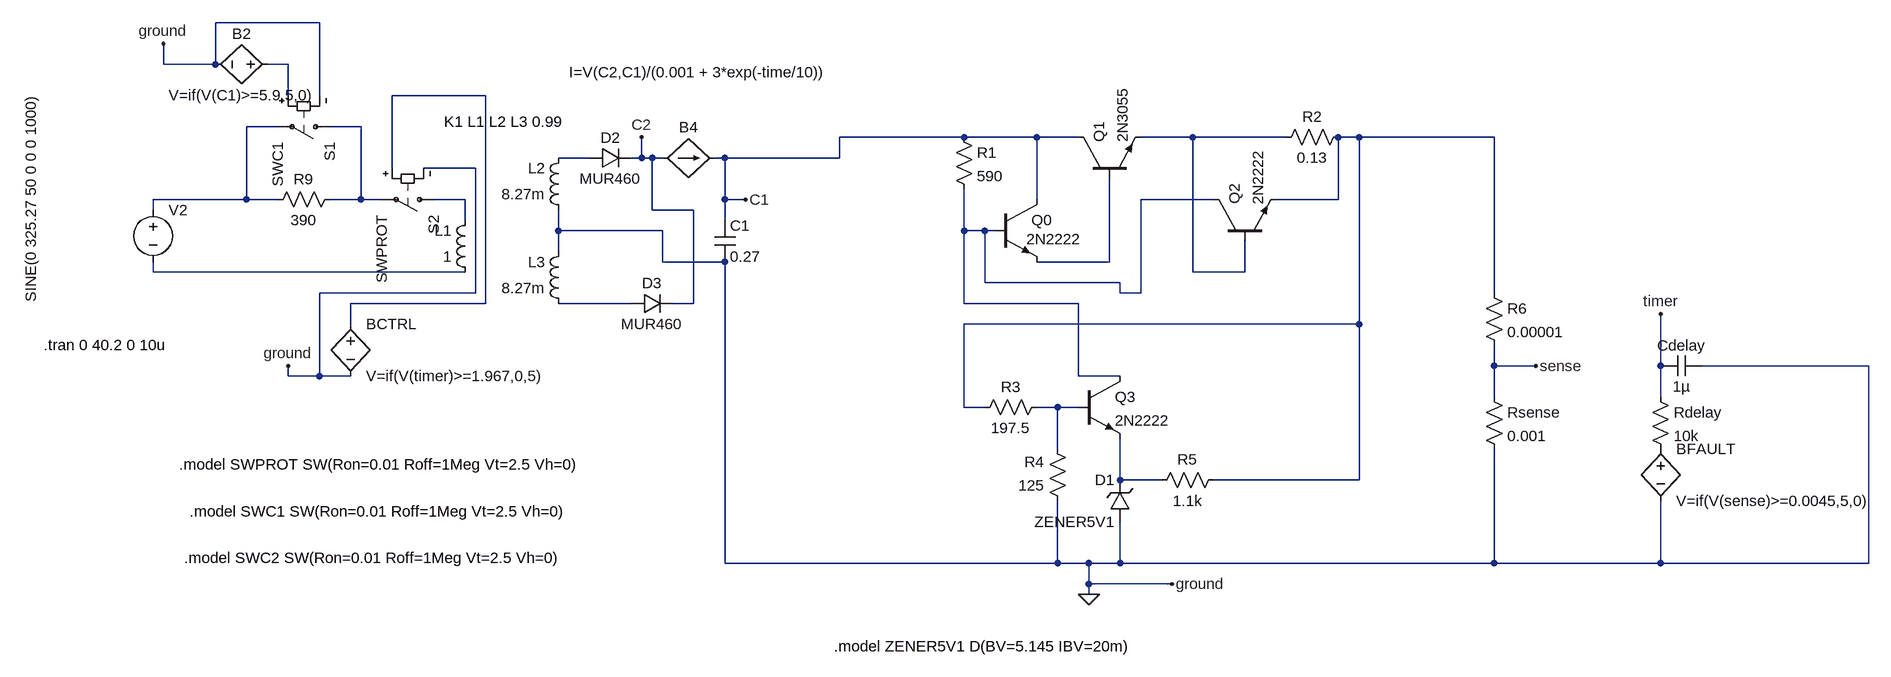
[diagram p0: schematic final... - Copy.asc]
final... - Copy.asc, the LTspice schematic file:
Version 4.1
SHEET 1 2704 768
WIRE -1232 -336 -1392 -336
WIRE -1472 -272 -1472 -304
WIRE -1392 -272 -1392 -336
WIRE -1392 -272 -1472 -272
WIRE -1280 -272 -1312 -272
WIRE -1280 -224 -1280 -272
WIRE -1232 -224 -1232 -336
WIRE -976 -224 -1120 -224
WIRE -1296 -176 -1344 -176
WIRE -1168 -176 -1216 -176
WIRE -240 -160 -432 -160
WIRE -128 -160 -240 -160
WIRE -64 -160 -128 -160
WIRE 112 -160 32 -160
WIRE 256 -160 112 -160
WIRE 368 -160 336 -160
WIRE 576 -160 368 -160
WIRE -816 -128 -864 -128
WIRE -736 -128 -736 -160
WIRE -736 -128 -752 -128
WIRE -720 -128 -736 -128
WIRE -704 -128 -720 -128
WIRE -608 -128 -624 -128
WIRE -432 -128 -432 -160
WIRE -432 -128 -608 -128
WIRE -1120 -112 -1120 -224
WIRE -992 -112 -1072 -112
WIRE -1344 -64 -1344 -176
WIRE -1344 -64 -1488 -64
WIRE -1296 -64 -1344 -64
WIRE -1168 -64 -1168 -176
WIRE -1168 -64 -1216 -64
WIRE -1136 -64 -1168 -64
WIRE -1008 -64 -1056 -64
WIRE -608 -64 -608 -128
WIRE -576 -64 -608 -64
WIRE -128 -64 -128 -160
WIRE 144 -64 32 -64
WIRE 336 -64 336 -160
WIRE 336 -64 240 -64
WIRE -1488 -48 -1488 -64
WIRE -720 -48 -720 -128
WIRE -656 -48 -720 -48
WIRE -1008 -32 -1008 -64
WIRE -608 -32 -608 -64
WIRE -864 -16 -864 -48
WIRE -704 -16 -864 -16
WIRE -240 -16 -240 -80
WIRE -208 -16 -240 -16
WIRE -192 -16 -208 -16
WIRE -864 16 -864 -16
WIRE -704 32 -704 -16
WIRE -608 32 -608 16
WIRE -608 32 -704 32
WIRE -16 32 -16 -96
WIRE -16 32 -128 32
WIRE -1488 48 -1488 32
WIRE -1008 48 -1488 48
WIRE 112 48 112 -160
WIRE 192 48 192 0
WIRE 192 48 112 48
WIRE -208 64 -208 -16
WIRE 0 64 -208 64
WIRE -992 80 -992 -112
WIRE -992 80 -1232 80
WIRE 0 80 0 64
WIRE 32 80 32 -64
WIRE 32 80 0 80
WIRE 576 80 576 -160
WIRE -976 96 -976 -224
WIRE -976 96 -1184 96
WIRE -752 96 -864 96
WIRE -656 96 -656 -48
WIRE -656 96 -688 96
WIRE -240 96 -240 -16
WIRE -64 96 -240 96
WIRE -1184 128 -1184 96
WIRE 368 128 368 -160
WIRE 368 128 -240 128
WIRE 576 192 576 160
WIRE 640 192 576 192
WIRE 832 192 832 112
WIRE 1152 192 896 192
WIRE -1280 208 -1280 192
WIRE -1232 208 -1232 80
WIRE -1232 208 -1280 208
WIRE -1184 208 -1232 208
WIRE -64 208 -64 96
WIRE 0 208 -64 208
WIRE 576 240 576 192
WIRE 832 240 832 192
WIRE -240 256 -240 128
WIRE -208 256 -240 256
WIRE -96 256 -128 256
WIRE -64 256 -96 256
WIRE -96 320 -96 256
WIRE 0 368 0 304
WIRE 64 368 0 368
WIRE 368 368 368 128
WIRE 368 368 144 368
WIRE -608 496 -608 32
WIRE -96 496 -96 400
WIRE -96 496 -608 496
WIRE -48 496 -96 496
WIRE 0 496 0 432
WIRE 0 496 -48 496
WIRE 576 496 576 320
WIRE 576 496 0 496
WIRE 832 496 832 400
WIRE 832 496 576 496
WIRE 1152 496 1152 192
WIRE 1152 496 832 496
WIRE -48 528 -48 496
WIRE 80 528 -48 528
WIRE -48 544 -48 528
FLAG -48 544 0
FLAG 640 192 sense
FLAG -576 -64 C1
FLAG 80 528 ground
FLAG -1280 192 ground
FLAG -1472 -304 ground
FLAG 832 112 timer
FLAG -736 -160 C2
SYMBOL npn -64 -96 R270
SYMATTR InstName Q1
SYMATTR Value 2N3055
SYMBOL npn 144 0 R270
SYMATTR InstName Q2
SYMATTR Value 2N2222
SYMBOL npn -64 208 R0
SYMATTR InstName Q3
SYMATTR Value 2N2222
SYMBOL res -256 -176 R0
SYMATTR InstName R1
SYMATTR Value 590
SYMATTR SpiceLine pwr=1
SYMBOL res 352 -176 R90
WINDOW 0 0 56 VBottom 2
WINDOW 3 32 56 VTop 2
SYMATTR InstName R2
SYMATTR Value 0.13
SYMATTR SpiceLine pwr=10
SYMBOL res -112 240 R90
WINDOW 0 0 56 VBottom 2
WINDOW 3 32 56 VTop 2
SYMATTR InstName R3
SYMATTR Value 197.5
SYMATTR SpiceLine pwr=1
SYMBOL res -80 416 R180
WINDOW 0 36 76 Left 2
WINDOW 3 36 40 Left 2
SYMATTR InstName R4
SYMATTR Value 125
SYMATTR SpiceLine pwr=1
SYMBOL res 48 384 R270
WINDOW 0 32 56 VTop 2
WINDOW 3 0 56 VBottom 2
SYMATTR InstName R5
SYMATTR Value 1.1k
SYMATTR SpiceLine pwr=0.25
SYMBOL zener 16 432 R180
WINDOW 0 24 64 Left 2
WINDOW 3 24 0 Left 2
SYMATTR InstName D1
SYMATTR Value ZENER5V1
SYMBOL voltage -1488 -64 R0
WINDOW 3 -188 158 VLeft 2
WINDOW 123 0 0 Left 0
WINDOW 39 0 0 Left 0
SYMATTR Value SINE(0 325.27 50 0 0 0 1000)
SYMATTR InstName V2
SYMBOL ind -992 64 R180
WINDOW 0 36 80 Left 2
WINDOW 3 36 40 Left 2
SYMATTR InstName L1
SYMATTR Value 1
SYMATTR Type ind
SYMATTR SpiceLine Rser=1m
SYMBOL ind -848 -32 R180
WINDOW 0 36 80 Left 2
WINDOW 3 36 40 Left 2
SYMATTR InstName L2
SYMATTR Value 8.27m
SYMATTR Type ind
SYMATTR SpiceLine Rser=1m
SYMBOL ind -848 112 R180
WINDOW 0 36 80 Left 2
WINDOW 3 36 40 Left 2
SYMATTR InstName L3
SYMATTR Value 8.27m
SYMATTR Type ind
SYMATTR SpiceLine Rser=1m
SYMBOL diode -816 -112 R270
WINDOW 0 32 32 VTop 2
WINDOW 3 0 32 VBottom 2
SYMATTR InstName D2
SYMATTR Value MUR460
SYMBOL diode -752 112 R270
WINDOW 0 32 32 VTop 2
WINDOW 3 0 32 VBottom 2
SYMATTR InstName D3
SYMATTR Value MUR460
SYMBOL cap -624 -32 R0
SYMATTR InstName C1
SYMATTR Value 0.27
SYMATTR SpiceLine Rpar=61
SYMBOL npn -192 -64 R0
WINDOW 3 48 61 Left 2
SYMATTR Value 2N2222
SYMATTR InstName Q0
SYMBOL sw -1200 -176 R90
SYMATTR InstName S1
SYMATTR Value SWC1
SYMBOL sw -1040 -64 R90
SYMATTR InstName S2
SYMATTR Value SWPROT
SYMBOL res 560 224 R0
SYMATTR InstName Rsense
SYMATTR Value 0.001
SYMATTR SpiceLine pwr=5
SYMBOL res -1200 -80 R90
WINDOW 0 0 56 VBottom 2
WINDOW 3 32 56 VTop 2
SYMATTR InstName R9
SYMATTR Value 390
SYMBOL bv -1184 112 R0
SYMATTR InstName BCTRL
SYMATTR Value V=if(V(timer)>=1.967,0,5)
SYMBOL bv -1296 -272 R90
WINDOW 0 -32 56 VBottom 2
WINDOW 3 32 56 VTop 2
SYMATTR InstName B2
SYMATTR Value V=if(V(C1)>=5.9,5,0)
SYMBOL bv 832 304 R0
SYMATTR InstName BFAULT
SYMATTR Value V=if(V(sense)>=0.0045,5,0)
SYMBOL res 816 224 R0
SYMATTR InstName Rdelay
SYMATTR Value 10k
SYMBOL cap 896 176 R90
WINDOW 0 0 32 VBottom 2
WINDOW 3 32 32 VTop 2
SYMATTR InstName Cdelay
SYMATTR Value 1µ
SYMBOL res 560 64 R0
SYMATTR InstName R6
SYMATTR Value 0.00001
SYMATTR SpiceLine pwr=100
SYMBOL bi -704 -128 R270
WINDOW 0 32 40 VTop 2
WINDOW 3 148 56 VBottom 2
SYMATTR InstName B4
SYMATTR Value I=V(C2,C1)/(0.001 + 3*exp(-time/10))
TEXT -440 624 Left 2 !.model ZENER5V1 D(BV=5.145 IBV=20m)
TEXT -1040 -184 Left 2 !K1 L1 L2 L3 0.99
TEXT -1656 160 Left 2 !.tran 0 40.2 0 10u
TEXT -1448 344 Left 2 !.model SWPROT SW(Ron=0.01 Roff=1Meg Vt=2.5 Vh=0)
TEXT -1432 416 Left 2 !.model SWC1 SW(Ron=0.01 Roff=1Meg Vt=2.5 Vh=0)
TEXT -1440 488 Left 2 !.model SWC2 SW(Ron=0.01 Roff=1Meg Vt=2.5 Vh=0)

The netlist it stands for:
* final... - Copy.asc
Q1 C1 N010 N005 0 2N3055
Q2 N009 N005 N006 0 2N2222
Q3 N009 N013 N014 0 2N2222
R1 C1 N009 590 pwr=1
R2 N006 N005 0.13 pwr=10
R3 N013 N006 197.5 pwr=1
R4 0 N013 125 pwr=1
R5 N014 N006 1.1k pwr=0.25
D1 0 N014 ZENER5V1
V2 N003 N011 SINE(0 325.27 50 0 0 0 1000)
L1 N011 N008 1 Rser=1m
L2 0 N007 8.27m Rser=1m
L3 N012 0 8.27m Rser=1m
D2 N007 C2 MUR460
D3 N012 C2 MUR460
C1 C1 0 0.27 Rpar=61
Q0 C1 N009 N010 0 2N2222
S1 N004 N003 N001 0 SWC1
S2 N008 N004 N002 0 SWPROT
Rsense sense 0 0.001 pwr=5
R9 N004 N003 390
BCTRL N002 0 V=if(V(timer)>=1.967,0,5)
B2 N001 0 V=if(V(C1)>=5.9,5,0)
BFAULT P001 0 V=if(V(sense)>=0.0045,5,0)
Rdelay timer P001 10k
Cdelay 0 timer 1µ
R6 N006 sense 0.00001 pwr=100
B4 C2 C1 I=V(C2,C1)/(0.001 + 3*exp(-time/10))
.model D D
.lib standard.dio
.model NPN NPN
.model PNP PNP
.lib standard.bjt
.model ZENER5V1 D(BV=5.145 IBV=20m)
K1 L1 L2 L3 0.99
.tran 0 40.2 0 10u
.model SWPROT SW(Ron=0.01 Roff=1Meg Vt=2.5 Vh=0)
.model SWC1 SW(Ron=0.01 Roff=1Meg Vt=2.5 Vh=0)
.model SWC2 SW(Ron=0.01 Roff=1Meg Vt=2.5 Vh=0)
.backanno
.end